# Altium schematic sheet Booster2.SchDoc (part 2 of 3)
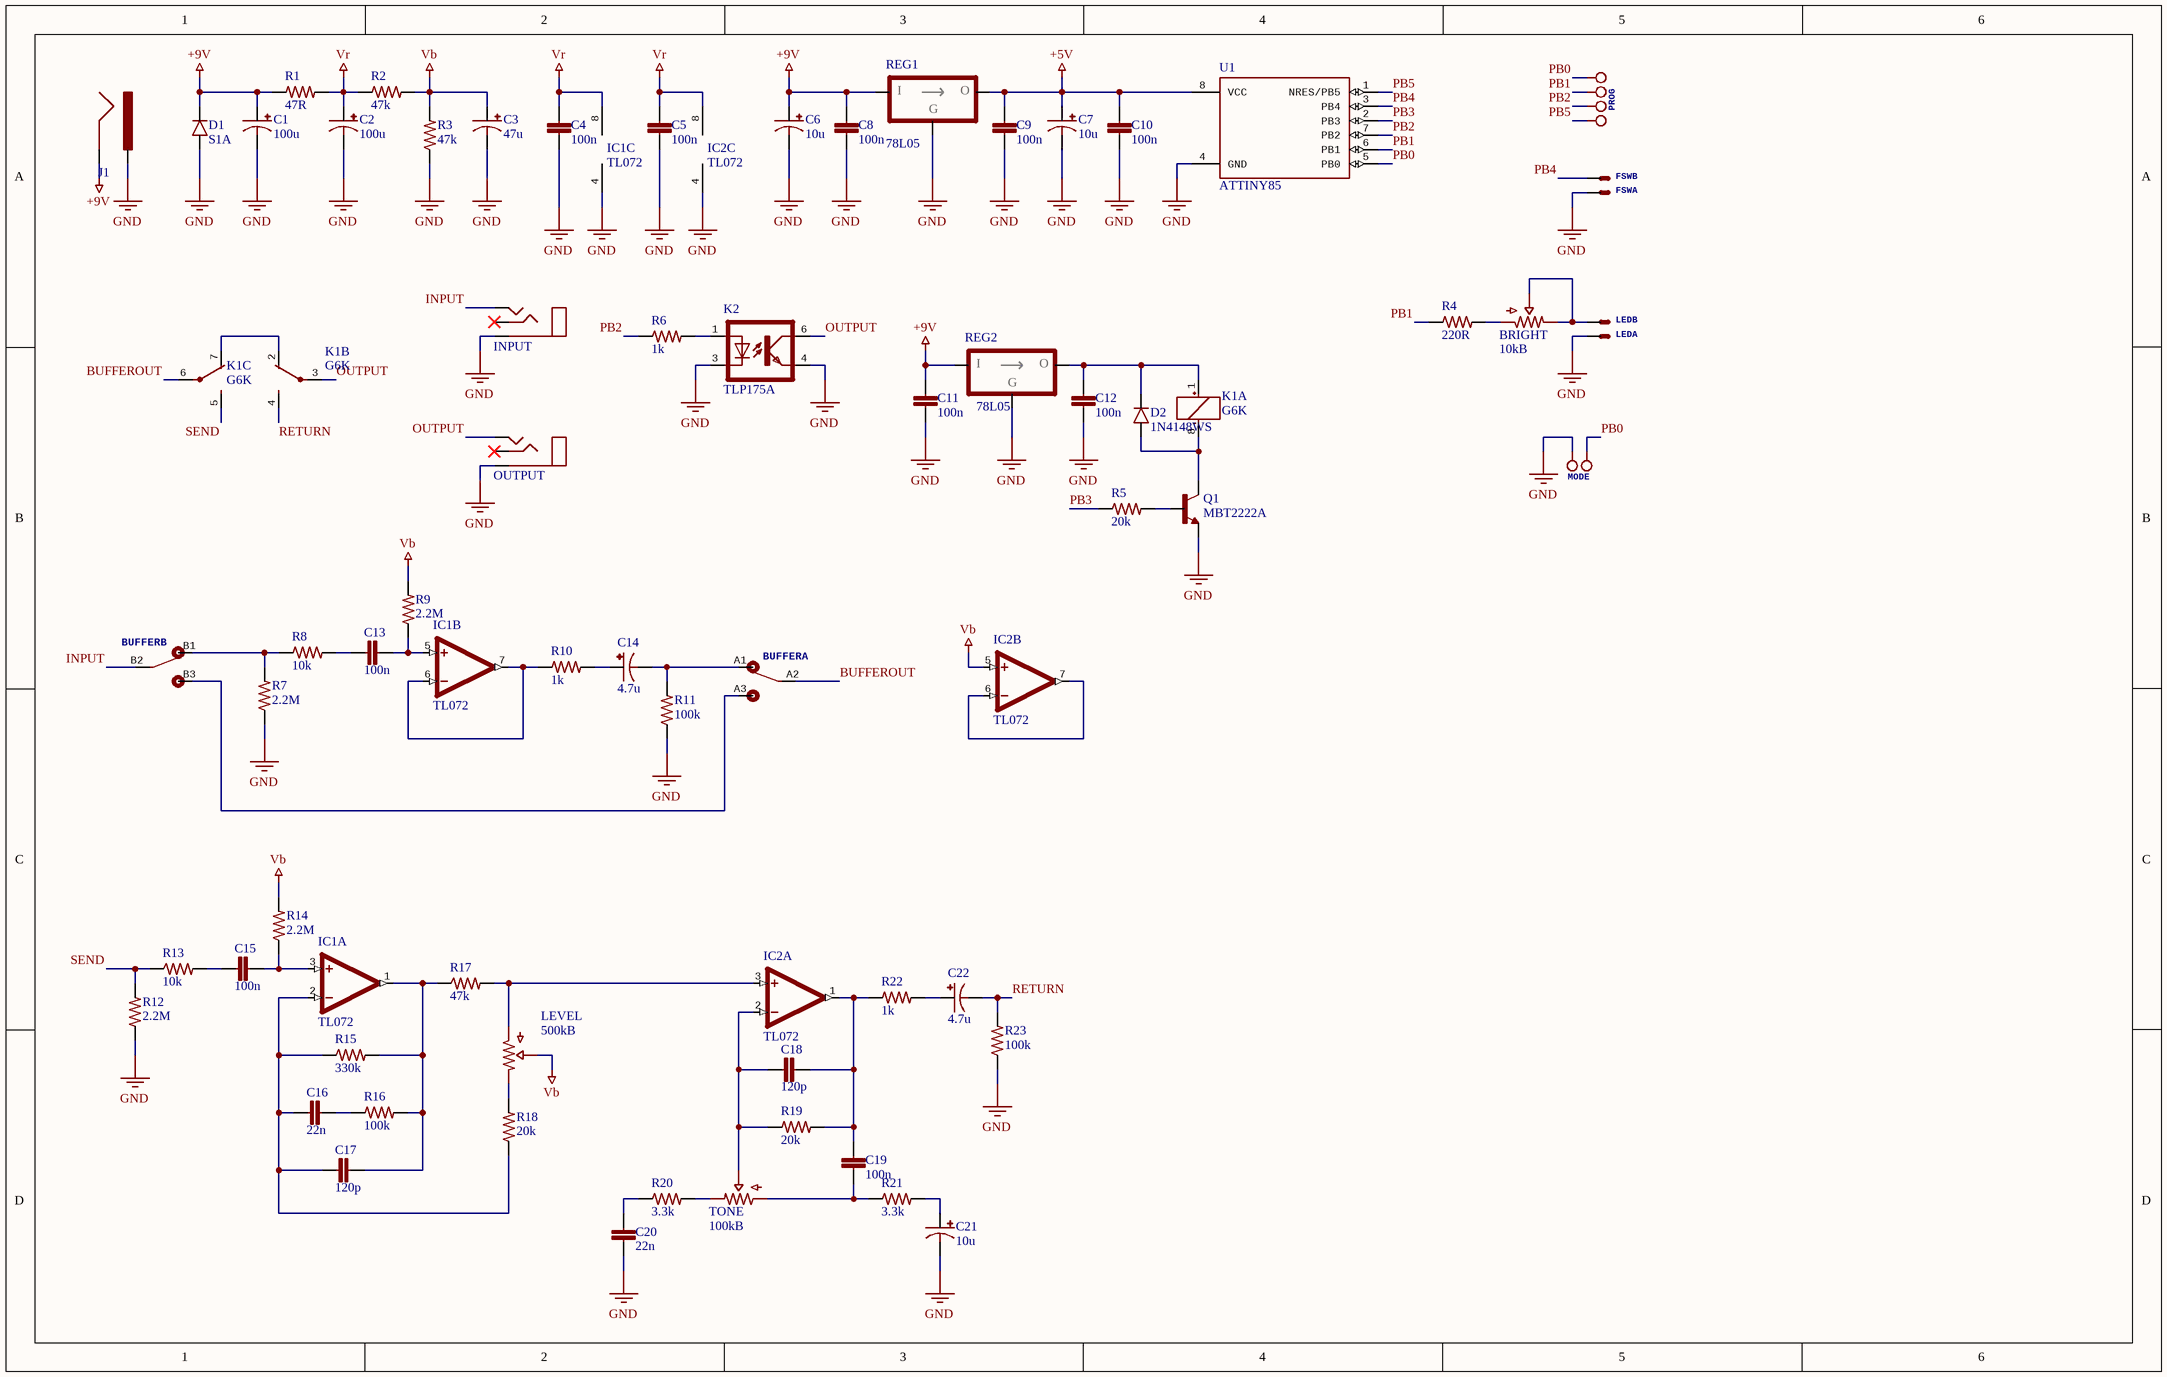
[diagram p1: Booster2.SchDoc]
## Library data of the parts
BRIGHT = TRIM_10kB_3362P: 10k Lin 3362P trimmer; Price: 0.1
BUFFER = SW_SLIDE_DPDT_ON-ON: DPDT slide switch ON/ON; Price: 0.5
C1 C2 = MCVVT025M101EA6L: CAP ALUM 100UF 25V SMD; Manufacturer: Multicomp; Life (Hours): 2000Hour; Ripple Current (AC): 6.3mA; Supplier 1: Farnell; Supplier Part Number 1: 2611370; Manufacturer Part Number: MCVVT025M101EA6L; Stock: 1063; Pricing: 1=0.157, 50=0.104, 100=0.0932, 250=0.0801, 500=0.0681 (EUR); RoHS: No; Min Operating Temperature: -55°C; Max Operating Temperature: 105°C; Capacitance: 100uF; Voltage Rating: 25V; Packaging: Tape and Reel; Voltage Rating (DC): 25V; Diameter: 6.3mm; Height: 7.7mm; REACH SVHC: No SVHC; ComponentLink1URL: http://www.farnell.com/datasheets/2151198.pdf?src-supplier=Element14; ComponentLink1Description: http://www.farnell.com/datasheets/2151198.pdf?src-supplier=Element14; Price: 0.102
C3 = MCVVT025M470EA1L: CAP ALUM 47UF 25V SMD; Manufacturer: Multicomp; Life (Hours): 2000Hour; Ripple Current (AC): 6.3mA; Supplier 1: Farnell; Supplier Part Number 1: 2611377; Manufacturer Part Number: MCVVT025M470EA1L; Stock: 1436; Pricing: 1=0.125, 50=0.0825, 100=0.0741, 250=0.0637, 500=0.0542 (EUR); RoHS: No; Min Operating Temperature: -55°C; Max Operating Temperature: 105°C; Capacitance: 47uF; Voltage Rating: 25V; Packaging: Cut Tape; Voltage Rating (DC): 25V; Diameter: 6.3mm; Height: 5.4mm; REACH SVHC: No SVHC; ComponentLink1URL: http://www.farnell.com/datasheets/2151198.pdf?src-supplier=Farnell; ComponentLink1Description: http://www.farnell.com/datasheets/2151198.pdf?src-supplier=Farnell; ComponentLink2URL: http://www.farnell.com/datasheets/2151198.pdf?src-supplier=Element14; ComponentLink2Description: http://www.farnell.com/datasheets/2151198.pdf?src-supplier=Element14; Price: 0.0825
C4 C5 C8-C12 = MC0603B104K500CT: CAP CER 100NF 50V X7R 0603; Manufacturer: Multicomp; Tolerance: 10%; Supplier 1: Farnell; Supplier Part Number 1: 1759122; Manufacturer Part Number: MC0603B104K500CT; Stock 1: 1057763; RoHS: Yes; Case/Package: 0603; Number of Pins: 2; Case Code (Metric): 1608; Case Code (Imperial): 0603; Min Operating Temperature: -55°C; Max Operating Temperature: 125°C; Packaging: Cut Tape; Voltage Rating: 50V; Capacitance: 100nF; Dielectric: X7R; Voltage Rating (DC): 50V; REACH SVHC: Unknown; ComponentLink1URL: https://datasheet.ciiva.com/22686/1901289-22686278.pdf?src-supplier=Element14; ComponentLink1Description: https://datasheet.ciiva.com/22686/1901289-22686278.pdf?src-supplier=Element14; ComponentLink2URL: https://datasheet.ciiva.com/22686/1901289-22686279.pdf?src-supplier=Element14; ComponentLink2Description: https://datasheet.ciiva.com/22686/1901289-22686279.pdf?src-supplier=Element14; ComponentLink3URL: https://datasheet.ciiva.com/22648/1901289-22648411.pdf?src-supplier=Element14; ComponentLink3Description: https://datasheet.ciiva.com/22648/1901289-22648411.pdf?src-supplier=Element14; Price: 0.0458
C6 C7 = MCVVT025M100CA1L: CAP ALUM 10UF 25V SMD; Manufacturer: Multicomp; Life (Hours): 2000Hour; Ripple Current (AC): 4mA; Supplier 1: Farnell; Supplier Part Number 1: 2611368; Manufacturer Part Number: MCVVT025M100CA1L; Stock: 2773; Pricing: 5=0.0897, 50=0.0592, 250=0.0457, 500=0.0388, 1000=0.0338 (EUR); RoHS: No; Min Operating Temperature: -55°C; Max Operating Temperature: 105°C; Capacitance: 10uF; Voltage Rating: 25V; Packaging: Cut Tape; Voltage Rating (DC): 25V; Diameter: 4mm; Height: 5.4mm; REACH SVHC: No SVHC; ComponentLink1URL: http://www.farnell.com/datasheets/2151198.pdf?src-supplier=Element14; ComponentLink1Description: http://www.farnell.com/datasheets/2151198.pdf?src-supplier=Element14; Price: 0.0592
C13 C15 C19 = GRM31C5C1H104JA01L: CAP CER 100NF 50V C0G/NP0 1206; Manufacturer: Murata; Material: Ceramic; Tolerance: 5%; Dielectric: C0G; Temperature Coefficient: 30ppm/°C; Supplier 1: Farnell; Supplier Part Number 1: 2494294; Manufacturer Part Number: GRM31C5C1H104JA01L; Stock 1: 206865; Pricing 1: 5 = 0.62500, 50 = 0.31000, 250 = 0.29700, 500 = 0.22200, 1000 = 0.18900 (EUR); RoHS: Yes; Mount: Surface Mount; Case/Package: 1206; Weight: 0.000571oz; Case Code (Metric): 3216; Case Code (Imperial): 1206; Min Operating Temperature: -55°C; Max Operating Temperature: 125°C; Capacitance: 100nF; Packaging: Tape and Reel; Package Quantity: 1; Voltage Rating: 50V; Voltage Rating (DC): 50V; Termination: SMD/SMT; Voltage: 50V; Length: 3.2mm; Height: 1.6mm; Width: 0.063inch; Thickness: 0.071inch; Depth: 1.6mm; Radiation Hardening: No; REACH SVHC: No SVHC; Lead Free: Lead Free; ComponentLink1URL: https://datasheet.ciiva.com/11618/product-11618880.pdf?src-supplier=Avnet; ComponentLink1Description: https://datasheet.ciiva.com/11618/product-11618880.pdf?src-supplier=Avnet; ComponentLink2URL: https://datasheet.ciiva.com/29200/453430-da-01-en-vs-kondensator-1206-29200201.pdf?src-supplier=Conrad; ComponentLink2Description: https://datasheet.ciiva.com/29200/453430-da-01-en-vs-kondensator-1206-29200201.pdf?src-supplier=Conrad; ComponentLink3URL: https://datasheet.ciiva.com/5420/product-5420070.pdf?src-supplier=Mouser; ComponentLink3Description: https://datasheet.ciiva.com/5420/product-5420070.pdf?src-supplier=Mouser; ComponentLink4URL: https://datasheet.ciiva.com/16461/product-16461275.pdf?src-supplier=Future+Electronics; ComponentLink4Description: https://datasheet.ciiva.com/16461/product-16461275.pdf?src-supplier=Future+Electronics; ComponentLink5URL: https://datasheet.ciiva.com/6270/partnumbering-e-01-6270255.pdf?src-supplier=Digi-Key; ComponentLink5Description: https://datasheet.ciiva.com/6270/partnumbering-e-01-6270255.pdf?src-supplier=Digi-Key; Price: 0.31
C14 C22 = EEEFC1H4R7R: CAP ALUM 4.7UF 50V LESR SMD; Manufacturer: Panasonic; Dielectric Material: Aluminium; Tolerance: 20%; Ripple Current: 50mA; Impedance: 3R; Life (Hours): 1000Hour; Leakage Current: 3uA; Lead Length: 2.2mm; Supplier 1: Farnell; Supplier Part Number 1: 9694552; Manufacturer Part Number: EEEFC1H4R7R; Stock 1: 1971; Pricing 1: 1 = 0.26900, 50 = 0.18200, 100 = 0.14200, 250 = 0.13200, 500 = 0.09890 (EUR); RoHS: Yes; Mount: Surface Mount; Case/Package: Radial; Number of Pins: 2; Contact Plating: Tin; Min Operating Temperature: -40°C; Max Operating Temperature: 105°C; Capacitance: 4.7uF; Voltage Rating: 50V; Packaging: Tape and Reel; Package Quantity: 1; Ripple Current (AC): 50mA; Voltage Rating (DC): 50V; ESR (Equivalent Series Resistance): 3R; Termination: SMD/SMT; Voltage: 50V; Diameter: 5mm; Length: 5.5mm; Height: 5.4mm; Height - Seated (Max): 0.213inch; Lead Pitch: 1.5mm; Width: 5.3mm; Radiation Hardening: No; REACH SVHC: No SVHC; Lead Free: Lead Free; ComponentLink1URL: https://datasheet.ciiva.com/11778/0900766b806bc525-11778368.pdf?src-supplier=RSComponents; ComponentLink1Description: https://datasheet.ciiva.com/11778/0900766b806bc525-11778368.pdf?src-supplier=RSComponents; ComponentLink2URL: https://datasheet.ciiva.com/6196/31718-6196262.pdf?src-supplier=Farnell; ComponentLink2Description: https://datasheet.ciiva.com/6196/31718-6196262.pdf?src-supplier=Farnell; ComponentLink3URL: https://datasheet.ciiva.com/30150/aba0000ce5-30150534.pdf?src-supplier=Onlinecomponents.com; ComponentLink3Description: https://datasheet.ciiva.com/30150/aba0000ce5-30150534.pdf?src-supplier=Onlinecomponents.com; ComponentLink4URL: https://datasheet.ciiva.com/48542/eeefc-series-eng-tds-48542743.pdf?src-supplier=Distrelec; ComponentLink4Description: https://datasheet.ciiva.com/48542/eeefc-series-eng-tds-48542743.pdf?src-supplier=Distrelec; ComponentLink5URL: https://datasheet.ciiva.com/14595/70256381-14595032.pdf?src-supplier=Allied+Electronics; ComponentLink5Description: https://datasheet.ciiva.com/14595/70256381-14595032.pdf?src-supplier=Allied+Electronics; ComponentLink6URL: https://datasheet.ciiva.com/43485/31718-43485416.pdf?src-supplier=Farnell; ComponentLink6Description: https://datasheet.ciiva.com/43485/31718-43485416.pdf?src-supplier=Farnell; ComponentLink7URL: https://datasheet.ciiva.com/24072/aba0000ce5-68492-24072137.pdf?src-supplier=Mouser; ComponentLink7Description: https://datasheet.ciiva.com/24072/aba0000ce5-68492-24072137.pdf?src-supplier=Mouser; ComponentLink8URL: https://datasheet.ciiva.com/14602/70256381-14602202.pdf?src-supplier=Allied+Electronics; ComponentLink8Description: https://datasheet.ciiva.com/14602/70256381-14602202.pdf?src-supplier=Allied+Electronics; ComponentLink9URL: https://datasheet.ciiva.com/46376/31718-46376378.pdf?src-supplier=Element14; ComponentLink9Description: https://datasheet.ciiva.com/46376/31718-46376378.pdf?src-supplier=Element14; ComponentLink10URL: https://datasheet.ciiva.com/14596/70068018-14596798.pdf?src-supplier=Allied+Electronics; ComponentLink10Description: https://datasheet.ciiva.com/14596/70068018-14596798.pdf?src-supplier=Allied+Electronics; Price: 0.27
C16 C20 = GRM21B5C1H223JA01L: CAP CER 22NF 50V C0G/NP0 0805; Manufacturer: Murata; Material: Ceramic; Tolerance: 5%; Dielectric: C0G; Voltage: 25V; Temperature Coefficient: 30ppm/°C; Supplier 1: Farnell; Supplier Part Number 1: 1828943; Manufacturer Part Number: GRM21B5C1H223JA01L; Stock 1: 85144; Pricing 1: 5 = 0.38000, 50 = 0.19100, 250 = 0.16400, 500 = 0.10400, 1500 = 0.08380 (EUR); RoHS: Yes; Mount: Surface Mount; Case/Package: 0805; Number of Pins: 2; Case Code (Metric): 2012; Case Code (Imperial): 0805; Min Operating Temperature: -55°C; Max Operating Temperature: 125°C; Capacitance: 22nF; Voltage Rating: 50V; Package Quantity: 1; Packaging: Tape and Reel; Voltage Rating (DC): 50V; Termination: SMD/SMT; Length: 2mm; Height: 1.25mm; Width: 0.049inch; Thickness: 0.053inch; Depth: 1.25mm; Radiation Hardening: No; REACH SVHC: No SVHC; Lead Free: Lead Free; ComponentLink1URL: https://datasheet.ciiva.com/2989/product-2989681.pdf?src-supplier=Avnet; ComponentLink1Description: https://datasheet.ciiva.com/2989/product-2989681.pdf?src-supplier=Avnet; ComponentLink2URL: https://datasheet.ciiva.com/29042/1858738-29042965.pdf?src-supplier=Jameco; ComponentLink2Description: https://datasheet.ciiva.com/29042/1858738-29042965.pdf?src-supplier=Jameco; ComponentLink3URL: https://datasheet.ciiva.com/3777/99grm21b5c1h223ja0123-3777023.pdf?src-supplier=Arrow; ComponentLink3Description: https://datasheet.ciiva.com/3777/99grm21b5c1h223ja0123-3777023.pdf?src-supplier=Arrow; ComponentLink4URL: https://datasheet.ciiva.com/29200/453051-da-01-en-vs-kondensator-0805-29200670.pdf?src-supplier=Conrad; ComponentLink4Description: https://datasheet.ciiva.com/29200/453051-da-01-en-vs-kondensator-0805-29200670.pdf?src-supplier=Conrad; ComponentLink5URL: https://datasheet.ciiva.com/138/partnumbering-e-01-138787.pdf?src-supplier=Digi-Key; ComponentLink5Description: https://datasheet.ciiva.com/138/partnumbering-e-01-138787.pdf?src-supplier=Digi-Key; ComponentLink6URL: https://datasheet.ciiva.com/138/partnumbering-e-01-138789.pdf?src-supplier=Digi-Key; ComponentLink6Description: https://datasheet.ciiva.com/138/partnumbering-e-01-138789.pdf?src-supplier=Digi-Key; ComponentLink7URL: https://datasheet.ciiva.com/22703/608985-22703464.pdf?src-supplier=Element14; ComponentLink7Description: https://datasheet.ciiva.com/22703/608985-22703464.pdf?src-supplier=Element14; ComponentLink8URL: https://datasheet.ciiva.com/7828/608985-7828990.pdf?src-supplier=Element14; ComponentLink8Description: https://datasheet.ciiva.com/7828/608985-7828990.pdf?src-supplier=Element14; ComponentLink9URL: https://datasheet.ciiva.com/138/partnumbering-e-01-138788.pdf?src-supplier=Digi-Key; ComponentLink9Description: https://datasheet.ciiva.com/138/partnumbering-e-01-138788.pdf?src-supplier=Digi-Key; Price: 0.191
C17 C18 = MC0603N121J500CT: CAP CER 120PF 50V C0G/NP0 0603; Manufacturer: Multicomp; Tolerance: 5%; Dielectric: C0G; Temperature Coefficient: 30ppm/°C; Supplier 1: Farnell; Supplier Part Number 1: 1759067; Manufacturer Part Number: MC0603N121J500CT; Stock: 19090; Pricing: 10=0.0363, 100=0.0246, 500=0.0182, 1000=0.0144, 2000=0.0119 (EUR); RoHS: Yes; Case/Package: 0603; Number of Pins: 2; Case Code (Metric): 1608; Case Code (Imperial): 0603; Min Operating Temperature: -55°C; Max Operating Temperature: 125°C; Capacitance: 120pF; Voltage Rating: 50V; Packaging: Cut Tape; Voltage Rating (DC): 50V; Width: 0.8mm; REACH SVHC: Unknown; ComponentLink1URL: https://datasheet.ciiva.com/7751/ta-1098-7751430.pdf?src-supplier=Element14; ComponentLink1Description: https://datasheet.ciiva.com/7751/ta-1098-7751430.pdf?src-supplier=Element14; ComponentLink2URL: https://datasheet.ciiva.com/22648/1901289-22648473.pdf?src-supplier=Element14; ComponentLink2Description: https://datasheet.ciiva.com/22648/1901289-22648473.pdf?src-supplier=Element14; ComponentLink3URL: https://datasheet.ciiva.com/22648/1901289-22648474.pdf?src-supplier=Element14; ComponentLink3Description: https://datasheet.ciiva.com/22648/1901289-22648474.pdf?src-supplier=Element14; ComponentLink4URL: https://datasheet.ciiva.com/41653/ta-1098-41653965.pdf?src-supplier=Farnell; ComponentLink4Description: https://datasheet.ciiva.com/41653/ta-1098-41653965.pdf?src-supplier=Farnell; Price: 0.0246
C21 = EEEFC1H100P: CAP ALUM 10UF 20% 50V LESR SMD; Manufacturer: Panasonic; Material: Aluminium; Ripple Current: 70mA; Impedance: 2R; Polarity: Polar; Life (Hours): 1000Hour; Leakage Current: 3uA; Lead Length: 2.6mm; Supplier 1: Farnell; Supplier Part Number 1: 9694560; Manufacturer Part Number: EEEFC1H100P; Stock: 7178; Pricing: 1=0.369, 50=0.219, 100=0.16, 250=0.156, 500=0.118 (EUR); RoHS: Yes; Mount: Surface Mount; Case/Package: Radial; Number of Pins: 2; Dielectric Material: Aluminium; Min Operating Temperature: -40°C; Max Operating Temperature: 105°C; Capacitance: 10uF; Tolerance: 20%; Voltage Rating: 50V; Packaging: Tape and Reel; Package Quantity: 1000; Ripple Current (AC): 70mA; Voltage Rating (DC): 50V; ESR (Equivalent Series Resistance): 2R; Termination: SMD/SMT; Voltage: 50V; Diameter: 6.3mm; Length: 5.5mm; Height: 5.4mm; Lead Pitch: 1.8mm; Height - Seated (Max): 0.213inch; Width: 6.6mm; Radiation Hardening: No; REACH SVHC: No SVHC; Lead Free: Lead Free; ComponentLink1URL: https://datasheet.ciiva.com/11777/0900766b80e4a876-11777374.pdf?src-supplier=RSComponents; ComponentLink1Description: https://datasheet.ciiva.com/11777/0900766b80e4a876-11777374.pdf?src-supplier=RSComponents; ComponentLink2URL: https://datasheet.ciiva.com/25613/0900766b806bc525-25613719.pdf?src-supplier=RSComponents; ComponentLink2Description: https://datasheet.ciiva.com/25613/0900766b806bc525-25613719.pdf?src-supplier=RSComponents; ComponentLink3URL: https://datasheet.ciiva.com/43485/31718-43485417.pdf?src-supplier=Farnell; ComponentLink3Description: https://datasheet.ciiva.com/43485/31718-43485417.pdf?src-supplier=Farnell; ComponentLink4URL: https://datasheet.ciiva.com/43463/31718-43463467.pdf?src-supplier=Farnell; ComponentLink4Description: https://datasheet.ciiva.com/43463/31718-43463467.pdf?src-supplier=Farnell; ComponentLink5URL: https://datasheet.ciiva.com/46376/31718-46376383.pdf?src-supplier=Element14; ComponentLink5Description: https://datasheet.ciiva.com/46376/31718-46376383.pdf?src-supplier=Element14; ComponentLink6URL: https://datasheet.ciiva.com/14603/70256381-14603525.pdf?src-supplier=Allied+Electronics; ComponentLink6Description: https://datasheet.ciiva.com/14603/70256381-14603525.pdf?src-supplier=Allied+Electronics; ComponentLink7URL: https://datasheet.ciiva.com/16394/aba0000ce5-16394405.pdf?src-supplier=Future+Electronics; ComponentLink7Description: https://datasheet.ciiva.com/16394/aba0000ce5-16394405.pdf?src-supplier=Future+Electronics; ComponentLink8URL: https://datasheet.ciiva.com/48542/eeefc-series-eng-tds-48542742.pdf?src-supplier=Distrelec; ComponentLink8Description: https://datasheet.ciiva.com/48542/eeefc-series-eng-tds-48542742.pdf?src-supplier=Distrelec; ComponentLink9URL: https://datasheet.ciiva.com/24069/aba0000ce5-68492-24069287.pdf?src-supplier=Mouser; ComponentLink9Description: https://datasheet.ciiva.com/24069/aba0000ce5-68492-24069287.pdf?src-supplier=Mouser; ComponentLink10URL: https://datasheet.ciiva.com/14588/70068018-14588537.pdf?src-supplier=Allied+Electronics; ComponentLink10Description: https://datasheet.ciiva.com/14588/70068018-14588537.pdf?src-supplier=Allied+Electronics; ComponentLink11URL: https://datasheet.ciiva.com/6121/31718-6121404.pdf?src-supplier=Farnell; ComponentLink11Description: https://datasheet.ciiva.com/6121/31718-6121404.pdf?src-supplier=Farnell; ComponentLink12URL: https://datasheet.ciiva.com/46388/31718-46388044.pdf?src-supplier=Element14; ComponentLink12Description: https://datasheet.ciiva.com/46388/31718-46388044.pdf?src-supplier=Element14; ComponentLink13URL: https://datasheet.ciiva.com/30236/aba0000ce5-30236333.pdf?src-supplier=Onlinecomponents.com; ComponentLink13Description: https://datasheet.ciiva.com/30236/aba0000ce5-30236333.pdf?src-supplier=Onlinecomponents.com; ComponentLink14URL: https://datasheet.ciiva.com/46388/31718-46388045.pdf?src-supplier=Element14; ComponentLink14Description: https://datasheet.ciiva.com/46388/31718-46388045.pdf?src-supplier=Element14; ComponentLink15URL: https://datasheet.ciiva.com/16539/aba0000ce5-16539967.pdf?src-supplier=Avnet+Asia; ComponentLink15Description: https://datasheet.ciiva.com/16539/aba0000ce5-16539967.pdf?src-supplier=Avnet+Asia; Price: 0.174
D1 = S1A: DIODE GEN PURP 50V 1A SMA; Manufacturer: ON Semiconductor / Fairchild; Peak Reverse Current: 1uA; Max Surge Current: 40A; Forward Voltage: 1.1V; Peak Non-Repetitive Surge Current: 30A; Element Configuration: Single; Capacitance: 12pF; Recovery Time: 1800ns; Reverse Recovery Time: 1.8us; Polarity: Standard; Power Dissipation: 1.4W; Supplier 1: Farnell; Supplier Part Number 1: 9843868; Manufacturer Part Number: S1A; Stock: 34555; Pricing: 5=0.184, 25=0.179, 100=0.0727, 250=0.0669, 500=0.0667, 1000=0.0364, 5000=0.0293 (EUR); RoHS: Yes; Mount: Surface Mount; Case/Package: SMA; Number of Pins: 2; Weight: 0.106g; Contact Plating: Tin; Min Operating Temperature: -55°C; Max Operating Temperature: 150°C; Packaging: Tape and Reel; Package Quantity: 1; Voltage Rating (DC): 50V; Current Rating: 1A; Output Current: 1A; Forward Current: 1A; Max Repetitive Reverse Voltage (Vrrm): 50V; Average Rectified Current: 1A; Max Forward Surge Current (Ifsm): 30A; Max Reverse Voltage (DC): 50V; Reverse Voltage: 50V; Width: 5.28mm; Radiation Hardening: No; REACH SVHC: No SVHC; Lead Free: Lead Free; ComponentLink1URL: https://datasheet.ciiva.com/910/s1a-910480.pdf?src-supplier=Avnet; ComponentLink1Description: https://datasheet.ciiva.com/910/s1a-910480.pdf?src-supplier=Avnet; ComponentLink2URL: https://datasheet.ciiva.com/23683/1730038-23683616.pdf?src-supplier=Newark; ComponentLink2Description: https://datasheet.ciiva.com/23683/1730038-23683616.pdf?src-supplier=Newark; ComponentLink3URL: https://datasheet.ciiva.com/4452/s1a-191336-4452662.pdf?src-supplier=Mouser; ComponentLink3Description: https://datasheet.ciiva.com/4452/s1a-191336-4452662.pdf?src-supplier=Mouser; ComponentLink4URL: https://datasheet.ciiva.com/25624/0900766b80f9b629-25624903.pdf?src-supplier=RSComponents; ComponentLink4Description: https://datasheet.ciiva.com/25624/0900766b80f9b629-25624903.pdf?src-supplier=RSComponents; ComponentLink5URL: https://datasheet.ciiva.com/916/s1a-916898.pdf?src-supplier=Digi-Key; ComponentLink5Description: https://datasheet.ciiva.com/916/s1a-916898.pdf?src-supplier=Digi-Key; ComponentLink6URL: https://datasheet.ciiva.com/916/s1a-916899.pdf?src-supplier=Digi-Key; ComponentLink6Description: https://datasheet.ciiva.com/916/s1a-916899.pdf?src-supplier=Digi-Key; ComponentLink7URL: https://datasheet.ciiva.com/916/s1a-916900.pdf?src-supplier=Digi-Key; ComponentLink7Description: https://datasheet.ciiva.com/916/s1a-916900.pdf?src-supplier=Digi-Key; ComponentLink8URL: https://datasheet.ciiva.com/16800/s1a-16800103.pdf?src-supplier=Future+Electronics; ComponentLink8Description: https://datasheet.ciiva.com/16800/s1a-16800103.pdf?src-supplier=Future+Electronics; ComponentLink9URL: https://datasheet.ciiva.com/28469/1766308-28469031.pdf?src-supplier=Element14; ComponentLink9Description: https://datasheet.ciiva.com/28469/1766308-28469031.pdf?src-supplier=Element14; ComponentLink10URL: https://datasheet.ciiva.com/26231/s1k-26231832.pdf?src-supplier=Avnet+Europe; ComponentLink10Description: https://datasheet.ciiva.com/26231/s1k-26231832.pdf?src-supplier=Avnet+Europe; ComponentLink11URL: https://datasheet.ciiva.com/16474/s1k-16474283.pdf?src-supplier=Avnet+Asia; ComponentLink11Description: https://datasheet.ciiva.com/16474/s1k-16474283.pdf?src-supplier=Avnet+Asia; Price: 0.072
D2 = 1N4148WS: DIODE GEN PURP 75V 150MA SOD323F; Manufacturer: ON Semiconductor / Fairchild; Element Configuration: Single; Reverse Recovery Time: 4ns; Forward Voltage: 1V; Peak Reverse Current: 5uA; Power Dissipation: 200mW; Max Forward Surge Current (Ifsm): 2A; Supplier 1: Farnell; Supplier Part Number 1: 2453269; Manufacturer Part Number: 1N4148WS; Stock: 379338; Pricing: 5=0.155, 25=0.151, 100=0.0529, 250=0.0498, 500=0.0477, 1000=0.0243, 5000=0.0193 (EUR); RoHS: Yes; Mount: Surface Mount; Number of Pins: 2; Weight: 0.0276g; Contact Plating: Tin; Min Operating Temperature: -55°C; Max Operating Temperature: 150°C; Forward Current: 150mA; Max Repetitive Reverse Voltage (Vrrm): 75V; Packaging: Tape and Reel; Package Quantity: 1; Average Rectified Current: 150mA; Max Reverse Voltage (DC): 75V; Recovery Time: 4ns; Reverse Voltage: 75V; Length: 1.8mm; Height: 1mm; Width: 1.35mm; Radiation Hardening: No; Lead Free: Lead Free; REACH SVHC: No SVHC; ComponentLink1URL: https://datasheet.ciiva.com/25968/1n914bws-25968945.pdf?src-supplier=Avnet+Europe; ComponentLink1Description: https://datasheet.ciiva.com/25968/1n914bws-25968945.pdf?src-supplier=Avnet+Europe; ComponentLink2URL: https://datasheet.ciiva.com/30479/0900766b810e1cd3-30479206.pdf?src-supplier=RSComponents; ComponentLink2Description: https://datasheet.ciiva.com/30479/0900766b810e1cd3-30479206.pdf?src-supplier=RSComponents; ComponentLink3URL: https://datasheet.ciiva.com/15208/getdatasheetpartid-127819-15208358.pdf?src-supplier=Verical; ComponentLink3Description: https://datasheet.ciiva.com/15208/getdatasheetpartid-127819-15208358.pdf?src-supplier=Verical; ComponentLink4URL: https://datasheet.ciiva.com/8300/1n914bws-8300360.pdf?src-supplier=Avnet; ComponentLink4Description: https://datasheet.ciiva.com/8300/1n914bws-8300360.pdf?src-supplier=Avnet; ComponentLink5URL: https://datasheet.ciiva.com/910/1n4148ws-910380.pdf?src-supplier=Digi-Key; ComponentLink5Description: https://datasheet.ciiva.com/910/1n4148ws-910380.pdf?src-supplier=Digi-Key; ComponentLink6URL: https://datasheet.ciiva.com/910/1n4148ws-910381.pdf?src-supplier=Digi-Key; ComponentLink6Description: https://datasheet.ciiva.com/910/1n4148ws-910381.pdf?src-supplier=Digi-Key; ComponentLink7URL: https://datasheet.ciiva.com/910/1n4148ws-910382.pdf?src-supplier=Digi-Key; ComponentLink7Description: https://datasheet.ciiva.com/910/1n4148ws-910382.pdf?src-supplier=Digi-Key; Price: 0.0521
FSW LED = J_JST-XH-02: 2 Pins male XH header; Price: 0.1
IC1 IC2 = TL072CDT: IC OPAMP JFET 4MHZ 8SO; Manufacturer: STMicroelectronics; Common Mode Rejection Ratio: 70dB; Min Dual Supply Voltage: 3V; Voltage Gain: 106.02dB; Slew Rate: 16V/µs; Min Supply Voltage: 6V; Max Supply Voltage: 36V; Max Dual Supply Voltage: 18V; Number of Channels: 2; Dual Supply Voltage: 9V; Output Current: 40mA; Nominal Supply Current: 2.5mA; Input Bias Current: 200pA; Input Offset Voltage (Vos): 10mV; Operating Supply Current: 1.4mA; Supplier 1: Farnell; Supplier Part Number 1: 1467663; Manufacturer Part Number: TL072CDT; Stock: 1760; Pricing: 5=0.351, 50=0.313, 100=0.188, 500=0.167, 1000=0.145 (EUR); RoHS: Yes; Mount: Surface Mount; Case/Package: SOIC; Number of Pins: 8; Weight: 0.01lb; Contact Plating: Tin; Min Operating Temperature: 0°C; Max Operating Temperature: 70°C; Gain Bandwidth Product: 4MHz; Unity Gain Bandwidth Product: 4MHz; Packaging: Tape and Reel; Package Quantity: 1; Bandwidth: 4MHz; Operating Supply Voltage: 18V; Number of Circuits: 2; Output Current per Channel: 40mA; Number of Elements: 2; Number of Amplifiers: 2; Length: 4.9mm; Height: 1.25mm; Width: 3.9mm; Radiation Hardening: No; REACH SVHC: No SVHC; Lead Free: Lead Free; ComponentLink1URL: https://datasheet.ciiva.com/15129/getdatasheetpartid-40113-15129688.pdf?src-supplier=Verical; ComponentLink1Description: https://datasheet.ciiva.com/15129/getdatasheetpartid-40113-15129688.pdf?src-supplier=Verical; ComponentLink2URL: https://datasheet.ciiva.com/29306/155616-da-01-en-op-verst-tl072cdt-stm-29306849.pdf?src-supplier=Conrad; ComponentLink2Description: https://datasheet.ciiva.com/29306/155616-da-01-en-op-verst-tl072cdt-stm-29306849.pdf?src-supplier=Conrad; ComponentLink3URL: https://datasheet.ciiva.com/26847/tl072cdt-26847276.pdf?src-supplier=IIIC; ComponentLink3Description: https://datasheet.ciiva.com/26847/tl072cdt-26847276.pdf?src-supplier=IIIC; ComponentLink4URL: https://datasheet.ciiva.com/1795/cd00000490-1795664.pdf?src-supplier=Digi-Key; ComponentLink4Description: https://datasheet.ciiva.com/1795/cd00000490-1795664.pdf?src-supplier=Digi-Key; ComponentLink5URL: https://datasheet.ciiva.com/1795/cd00000490-1795665.pdf?src-supplier=Digi-Key; ComponentLink5Description: https://datasheet.ciiva.com/1795/cd00000490-1795665.pdf?src-supplier=Digi-Key; ComponentLink6URL: https://datasheet.ciiva.com/1795/cd00000490-1795666.pdf?src-supplier=Digi-Key; ComponentLink6Description: https://datasheet.ciiva.com/1795/cd00000490-1795666.pdf?src-supplier=Digi-Key; ComponentLink7URL: https://datasheet.ciiva.com/8008/1674510-8008556.pdf?src-supplier=Element14; ComponentLink7Description: https://datasheet.ciiva.com/8008/1674510-8008556.pdf?src-supplier=Element14; ComponentLink8URL: https://datasheet.ciiva.com/14151/tl072-tl072a-tl072b-st-tds-eng-14151196.pdf?src-supplier=Distrelec; ComponentLink8Description: https://datasheet.ciiva.com/14151/tl072-tl072a-tl072b-st-tds-eng-14151196.pdf?src-supplier=Distrelec; ComponentLink9URL: https://datasheet.ciiva.com/8008/1674510-8008557.pdf?src-supplier=Element14; ComponentLink9Description: https://datasheet.ciiva.com/8008/1674510-8008557.pdf?src-supplier=Element14; Price: 0.351
INPUT OUTPUT = J_STEREO: 6.35mm stereo insulated socket jack PCB mounted; Price: 0.5
J1 = J_DC_JACK: DC Power jack 2.1mm barrel; Price: 0.05
K1 = G6K-2F5DC: OMRON - G6K-2F 5DC - RELAY, SIGNAL, DPDT, 30VDC, 1A; Manufacturer: Cliff; Coil Resistance: 237R; Coil Voltage (DC): 5V; Coil Current: 21.1mA; Coil Power: 100mW; Coil Type: Non-Latching; Release Time: 1.3ms; Contact Resistance: 100mR; Insulation Resistance: 1GR; Number of Poles: 2; Supplier 1: Farnell; Supplier Part Number 1: 4446185; Manufacturer Part Number: G6K-2F5DC; Stock: 0; RoHS: Yes; Mount: PCB; Case/Package: SMD/SMT; Contact Material: Gold; Min Operating Temperature: -40°C; Max Operating Temperature: 70°C; Contact Current Rating: 1A; Termination: SMD/SMT; Current Rating: 21.1mA; Power Rating: 100mW; Length: 10mm; Height: 5.2mm; Depth: 7.8mm; Width: 10mm; REACH SVHC: Unknown; ComponentLink1URL: https://datasheet.ciiva.com/1524/1702879-1524968.pdf?src-supplier=Element14; ComponentLink1Description: https://datasheet.ciiva.com/1524/1702879-1524968.pdf?src-supplier=Element14; Price: 2.68
K2 = TLP175A: Toshiba TLP175A AC Input MOSFET Output Optocoupler, Surface Mount, 4-Pin SOIC; Isolation Voltage: 3.75kV; Max Input Current: 80mA; Number of Channels: 1; Rise Time: 1ms; Supplier 1: Farnell; Supplier Part Number 1: 2524257; Manufacturer: Toshiba; Manufacturer Part Number: TLP175A; Stock: 0; Pricing: 5=0.877, 25=0.717, 100=0.597, 250=0.546, 500=0.49, 1000=0.441 (EUR); RoHS: No; Mount: Surface Mount; Case/Package: SOIC; Number of Pins: 4; Fall Time: 1ms; REACH SVHC: Unknown; ComponentLink1URL: http://www.farnell.com/datasheets/2017792.pdf?src-supplier=Farnell; ComponentLink1Description: http://www.farnell.com/datasheets/2017792.pdf?src-supplier=Farnell; ComponentLink2URL: http://uk.rs-online.com/webdocs/129d/0900766b8129d5be.pdf?src-supplier=RSComponents; ComponentLink2Description: http://uk.rs-online.com/webdocs/129d/0900766b8129d5be.pdf?src-supplier=RSComponents; ComponentLink3URL: http://www.farnell.com/datasheets/2017792.pdf?src-supplier=Element14; ComponentLink3Description: http://www.farnell.com/datasheets/2017792.pdf?src-supplier=Element14; ComponentLink4URL: http://www.farnell.com/datasheets/2017792.pdf?src-supplier=Newark; ComponentLink4Description: http://www.farnell.com/datasheets/2017792.pdf?src-supplier=Newark; Price: 0.829
LEVEL = POT_500kB_ALPHA_16mm: 500k Lin potentiometer round shaft; Price: 0.5; Dimensions: 16mm; Package: PCB Mounted
MODE = J_HEADER_2PINS: 2 Pins male header; Pin spacing: 2.54mm; Price: 0.01
PROG = J_HEADER_4PINS_FEM: 4 Pins female header; Pin spacing: 2.54mm; Price: 0.01
Q1 = MMBT2222AWT1G: TRANS NPN 40V 0.6A SOT323; Manufacturer: ON Semiconductor; Frequency: 300MHz; hFE Min: 35; Max Power Dissipation: 150mW; Collector Base Voltage (VCBO): 75V; Emitter Base Voltage (VEBO): 6V; Collector Emitter Saturation Voltage: 1V; Max Collector Current: 600mA; Number of Elements: 1; Element Configuration: Single; Max Frequency: 100MHz; Current Rating: 28A; Supplier 1: Farnell; Supplier Part Number 1: 2317589; Manufacturer Part Number: MMBT2222AWT1G; Stock: 16918; Pricing: 5=0.118, 50=0.114, 100=0.0413, 500=0.025, 1500=0.024 (EUR); RoHS: Yes; Case/Package: SC; Number of Pins: 3; Contact Plating: Tin; Min Operating Temperature: -55°C; Max Operating Temperature: 150°C; Package Quantity: 1; Collector Emitter Voltage (VCEO): 40V; Packaging: Tape and Reel; Polarity: NPN; Collector Emitter Breakdown Voltage: 40V; Transition Frequency: 300MHz; Power Dissipation: 150mW; Gain Bandwidth Product: 300MHz; Max Breakdown Voltage: 40V; Voltage Rating (DC): 40V; Length: 2.2mm; Height: 1mm; Width: 1.35mm; Radiation Hardening: No; Lead Free: Lead Free; REACH SVHC: No SVHC; ComponentLink1URL: https://datasheet.ciiva.com/15139/getdatasheetpartid-76779-15139056.pdf?src-supplier=Verical; ComponentLink1Description: https://datasheet.ciiva.com/15139/getdatasheetpartid-76779-15139056.pdf?src-supplier=Verical; ComponentLink2URL: https://datasheet.ciiva.com/4722/mmbt2222awt1-d-110211-4722257.pdf?src-supplier=Mouser; ComponentLink2Description: https://datasheet.ciiva.com/4722/mmbt2222awt1-d-110211-4722257.pdf?src-supplier=Mouser; ComponentLink3URL: https://datasheet.ciiva.com/16478/mmbt2222awt1-d-16478517.pdf?src-supplier=Avnet+Asia; ComponentLink3Description: https://datasheet.ciiva.com/16478/mmbt2222awt1-d-16478517.pdf?src-supplier=Avnet+Asia; ComponentLink4URL: https://datasheet.ciiva.com/11201/mmbt2222awt1-d-11201756.pdf?src-supplier=Avnet; ComponentLink4Description: https://datasheet.ciiva.com/11201/mmbt2222awt1-d-11201756.pdf?src-supplier=Avnet; ComponentLink5URL: https://datasheet.ciiva.com/16221/mmbt2222awt1-d-16221845.pdf?src-supplier=Future+Electronics; ComponentLink5Description: https://datasheet.ciiva.com/16221/mmbt2222awt1-d-16221845.pdf?src-supplier=Future+Electronics; ComponentLink6URL: https://datasheet.ciiva.com/7972/mmbt2222awt1-d-7972374.pdf?src-supplier=Element14; ComponentLink6Description: https://datasheet.ciiva.com/7972/mmbt2222awt1-d-7972374.pdf?src-supplier=Element14; ComponentLink7URL: https://datasheet.ciiva.com/22664/1708260-22664154.pdf?src-supplier=Element14; ComponentLink7Description: https://datasheet.ciiva.com/22664/1708260-22664154.pdf?src-supplier=Element14; ComponentLink8URL: https://datasheet.ciiva.com/976/mmbt2222awt1-d-976443.pdf?src-supplier=Digi-Key; ComponentLink8Description: https://datasheet.ciiva.com/976/mmbt2222awt1-d-976443.pdf?src-supplier=Digi-Key; Price: 0.0413
R1 = CRCW120647R0FKEA: RES SMD 47 OHM 1% 1/4W 1206; Manufacturer: Vishay; Temperature Coefficient: 100ppm/°C; Power Rating: 250mW; Voltage Rating: 200V; Supplier 1: Farnell; Supplier Part Number 1: 1470017; Manufacturer Part Number: CRCW120647R0FKEA; Stock: 90018; Pricing: 10=0.0369, 100=0.0246, 500=0.0205, 1000=0.0135, 2500=0.0108 (EUR); RoHS: Yes; Mount: Surface Mount; Case/Package: 1206; Weight: 0.000353oz; Contact Plating: Tin; Case Code (Metric): 3216; Case Code (Imperial): 1206; Min Operating Temperature: -55°C; Max Operating Temperature: 155°C; Resistance: 47R; Tolerance: 1%; Composition: Thick Film; Termination: SMD/SMT; Package Quantity: 10; Packaging: Tape and Reel; Number of Terminations: 2; Military Standard: Not; Max Power Dissipation: 250mW; Features: Automotive AEC-Q200; Voltage Rating (DC): 200V; Length: 3.2mm; Height: 0.55mm; Width: 0.063inch; Depth: 1.6mm; Radiation Hardening: No; REACH SVHC: Unknown; Lead Free: Lead Free; ComponentLink1URL: https://datasheet.ciiva.com/11818/0900766b80d98b5e-11818252.pdf?src-supplier=RSComponents; ComponentLink1Description: https://datasheet.ciiva.com/11818/0900766b80d98b5e-11818252.pdf?src-supplier=RSComponents; ComponentLink2URL: https://datasheet.ciiva.com/2469/dcrcwe3-2469056.pdf?src-supplier=Digi-Key; ComponentLink2Description: https://datasheet.ciiva.com/2469/dcrcwe3-2469056.pdf?src-supplier=Digi-Key; ComponentLink3URL: https://datasheet.ciiva.com/16760/70201119-16760313.pdf?src-supplier=Allied+Electronics; ComponentLink3Description: https://datasheet.ciiva.com/16760/70201119-16760313.pdf?src-supplier=Allied+Electronics; ComponentLink4URL: https://datasheet.ciiva.com/9005/dcrcwe3-9005498.pdf?src-supplier=Avnet; ComponentLink4Description: https://datasheet.ciiva.com/9005/dcrcwe3-9005498.pdf?src-supplier=Avnet; ComponentLink5URL: https://datasheet.ciiva.com/2469/dcrcwe3-2469054.pdf?src-supplier=Digi-Key; ComponentLink5Description: https://datasheet.ciiva.com/2469/dcrcwe3-2469054.pdf?src-supplier=Digi-Key; ComponentLink6URL: https://datasheet.ciiva.com/9005/dcrcwe3-9005502.pdf?src-supplier=Avnet; ComponentLink6Description: https://datasheet.ciiva.com/9005/dcrcwe3-9005502.pdf?src-supplier=Avnet; ComponentLink7URL: https://datasheet.ciiva.com/16435/dcrcw-16435790.pdf?src-supplier=Future+Electronics; ComponentLink7Description: https://datasheet.ciiva.com/16435/dcrcw-16435790.pdf?src-supplier=Future+Electronics; ComponentLink8URL: https://datasheet.ciiva.com/16894/dcrcwe3-16894718.pdf?src-supplier=Avnet+Europe; ComponentLink8Description: https://datasheet.ciiva.com/16894/dcrcwe3-16894718.pdf?src-supplier=Avnet+Europe; ComponentLink9URL: https://datasheet.ciiva.com/7777/1697337-7777594.pdf?src-supplier=Element14; ComponentLink9Description: https://datasheet.ciiva.com/7777/1697337-7777594.pdf?src-supplier=Element14; ComponentLink10URL: https://datasheet.ciiva.com/15159/getdatasheetpartid-67741-15159676.pdf?src-supplier=Verical; ComponentLink10Description: https://datasheet.ciiva.com/15159/getdatasheetpartid-67741-15159676.pdf?src-supplier=Verical; ComponentLink11URL: https://datasheet.ciiva.com/2469/dcrcwe3-2469055.pdf?src-supplier=Digi-Key; ComponentLink11Description: https://datasheet.ciiva.com/2469/dcrcwe3-2469055.pdf?src-supplier=Digi-Key; Price: 0.0249
R2 R3 = CRCW120647K0FKEA: RES SMD 47K OHM 1% 1/4W 1206; Manufacturer: Vishay; Resistance: 47kR; Power Rating: 250mW; Temperature Coefficient: 100ppm/°C; Voltage Rating: 200V; Supplier 1: Farnell; Supplier Part Number 1: 1470016; Manufacturer Part Number: CRCW120647K0FKEA; Stock: 31528; Pricing: 10=0.0415, 100=0.0276, 500=0.0231, 1000=0.0135, 2500=0.0116 (EUR); RoHS: Yes; Case/Package: 1206; Weight: 0.000353oz; Contact Plating: Tin; Case Code (Imperial): 1206; Case Code (Metric): 3216; Min Operating Temperature: -55°C; Max Operating Temperature: 155°C; Tolerance: 1%; Composition: Thick Film; Termination: SMD/SMT; Packaging: Tape and Reel; Package Quantity: 10; Number of Terminations: 2; Military Standard: Not; Max Power Dissipation: 250mW; Voltage Rating (DC): 200V; Features: Automotive AEC-Q200; Length: 3.2mm; Height: 0.55mm; Width: 1.6mm; Depth: 1.6mm; Radiation Hardening: No; Lead Free: Lead Free; REACH SVHC: Unknown; ComponentLink1URL: https://datasheet.ciiva.com/11809/0900766b80d98b5e-11809091.pdf?src-supplier=RSComponents; ComponentLink1Description: https://datasheet.ciiva.com/11809/0900766b80d98b5e-11809091.pdf?src-supplier=RSComponents; ComponentLink2URL: https://datasheet.ciiva.com/16894/dcrcwe3-16894709.pdf?src-supplier=Avnet+Europe; ComponentLink2Description: https://datasheet.ciiva.com/16894/dcrcwe3-16894709.pdf?src-supplier=Avnet+Europe; ComponentLink3URL: https://datasheet.ciiva.com/26316/fld-crcw-e3-data-en-26316470.pdf?src-supplier=Distrelec; ComponentLink3Description: https://datasheet.ciiva.com/26316/fld-crcw-e3-data-en-26316470.pdf?src-supplier=Distrelec; ComponentLink4URL: https://datasheet.ciiva.com/7777/1697337-7777591.pdf?src-supplier=Element14; ComponentLink4Description: https://datasheet.ciiva.com/7777/1697337-7777591.pdf?src-supplier=Element14; ComponentLink5URL: https://datasheet.ciiva.com/7777/125364-7777592.pdf?src-supplier=Element14; ComponentLink5Description: https://datasheet.ciiva.com/7777/125364-7777592.pdf?src-supplier=Element14; ComponentLink6URL: https://datasheet.ciiva.com/16380/dcrcwe3-16380760.pdf?src-supplier=Future+Electronics; ComponentLink6Description: https://datasheet.ciiva.com/16380/dcrcwe3-16380760.pdf?src-supplier=Future+Electronics; ComponentLink7URL: https://datasheet.ciiva.com/2468/dcrcwe3-2468922.pdf?src-supplier=Digi-Key; ComponentLink7Description: https://datasheet.ciiva.com/2468/dcrcwe3-2468922.pdf?src-supplier=Digi-Key; ComponentLink8URL: https://datasheet.ciiva.com/2468/dcrcwe3-2468923.pdf?src-supplier=Digi-Key; ComponentLink8Description: https://datasheet.ciiva.com/2468/dcrcwe3-2468923.pdf?src-supplier=Digi-Key; ComponentLink9URL: https://datasheet.ciiva.com/2468/dcrcwe3-2468924.pdf?src-supplier=Digi-Key; ComponentLink9Description: https://datasheet.ciiva.com/2468/dcrcwe3-2468924.pdf?src-supplier=Digi-Key; ComponentLink10URL: https://datasheet.ciiva.com/7777/1697337-7777484.pdf?src-supplier=Element14; ComponentLink10Description: https://datasheet.ciiva.com/7777/1697337-7777484.pdf?src-supplier=Element14; ComponentLink11URL: https://datasheet.ciiva.com/22868/70201119-22868605.pdf?src-supplier=Allied+Electronics; ComponentLink11Description: https://datasheet.ciiva.com/22868/70201119-22868605.pdf?src-supplier=Allied+Electronics; ComponentLink12URL: https://datasheet.ciiva.com/9006/dcrcwe3-9006431.pdf?src-supplier=Avnet; ComponentLink12Description: https://datasheet.ciiva.com/9006/dcrcwe3-9006431.pdf?src-supplier=Avnet; Price: 0.028
R4 = CRCW1206220RFKEA: RES SMD 220 OHM 1% 1/4W 1206; Manufacturer: Vishay; Temperature Coefficient: 100ppm/°C; Power Rating: 250mW; Voltage Rating: 200V; Supplier 1: Farnell; Supplier Part Number 1: 2139380; Manufacturer Part Number: CRCW1206220RFKEA; Stock: 47111; Pricing: 10=0.0415, 100=0.0276, 500=0.0231, 1000=0.0135, 2500=0.0116 (EUR); RoHS: Yes; Mount: Surface Mount; Case/Package: 1206; Weight: 0.000353oz; Contact Plating: Tin; Case Code (Imperial): 1206; Case Code (Metric): 3216; Min Operating Temperature: -55°C; Max Operating Temperature: 155°C; Tolerance: 1%; Resistance: 220R; Composition: Thick Film; Packaging: Tape and Reel; Package Quantity: 10; Number of Terminations: 2; Termination: SMD/SMT; Military Standard: Not; Max Power Dissipation: 250mW; Voltage Rating (DC): 200V; Features: Automotive AEC-Q200; Length: 3.2mm; Height: 0.55mm; Width: 1.6mm; Depth: 1.6mm; Radiation Hardening: No; REACH SVHC: Unknown; Lead Free: Lead Free; ComponentLink1URL: https://datasheet.ciiva.com/5550/dcrcwe3-109170-5550679.pdf?src-supplier=Mouser; ComponentLink1Description: https://datasheet.ciiva.com/5550/dcrcwe3-109170-5550679.pdf?src-supplier=Mouser; ComponentLink2URL: https://datasheet.ciiva.com/17166/dcrcwe3-17166378.pdf?src-supplier=Avnet+Europe; ComponentLink2Description: https://datasheet.ciiva.com/17166/dcrcwe3-17166378.pdf?src-supplier=Avnet+Europe; ComponentLink3URL: https://datasheet.ciiva.com/2515/dcrcwe3-2515580.pdf?src-supplier=Digi-Key; ComponentLink3Description: https://datasheet.ciiva.com/2515/dcrcwe3-2515580.pdf?src-supplier=Digi-Key; ComponentLink4URL: https://datasheet.ciiva.com/2515/dcrcwe3-2515581.pdf?src-supplier=Digi-Key; ComponentLink4Description: https://datasheet.ciiva.com/2515/dcrcwe3-2515581.pdf?src-supplier=Digi-Key; ComponentLink5URL: https://datasheet.ciiva.com/2515/dcrcwe3-2515582.pdf?src-supplier=Digi-Key; ComponentLink5Description: https://datasheet.ciiva.com/2515/dcrcwe3-2515582.pdf?src-supplier=Digi-Key; ComponentLink6URL: https://datasheet.ciiva.com/8957/dcrcwe3-8957438.pdf?src-supplier=Avnet; ComponentLink6Description: https://datasheet.ciiva.com/8957/dcrcwe3-8957438.pdf?src-supplier=Avnet; ComponentLink7URL: https://datasheet.ciiva.com/22700/1697337-22700367.pdf?src-supplier=Element14; ComponentLink7Description: https://datasheet.ciiva.com/22700/1697337-22700367.pdf?src-supplier=Element14; ComponentLink8URL: https://datasheet.ciiva.com/26317/fld-crcw-e3-data-en-26317129.pdf?src-supplier=Distrelec; ComponentLink8Description: https://datasheet.ciiva.com/26317/fld-crcw-e3-data-en-26317129.pdf?src-supplier=Distrelec; ComponentLink9URL: https://datasheet.ciiva.com/7800/dcrcwe3-7800651.pdf?src-supplier=Element14; ComponentLink9Description: https://datasheet.ciiva.com/7800/dcrcwe3-7800651.pdf?src-supplier=Element14; ComponentLink10URL: https://datasheet.ciiva.com/22675/1912744-22675103.pdf?src-supplier=Element14; ComponentLink10Description: https://datasheet.ciiva.com/22675/1912744-22675103.pdf?src-supplier=Element14; Price: 0.028
R5 R18 R19 = CRCW060320K0FKEA: RES SMD 20K OHM 1% 1/10W 0603; Manufacturer: Vishay; Resistance: 20kR; Temperature Coefficient: 100ppm/°C; Power Rating: 100mW; Voltage Rating: 75V; Supplier 1: Farnell; Supplier Part Number 1: 1469774; Manufacturer Part Number: CRCW060320K0FKEA; Stock: 71220; Pricing: 10=0.0169, 100=0.013, 500=0.0113, 1000=0.008 (EUR); RoHS: Yes; Mount: Surface Mount; Case/Package: 0603; Number of Pins: 2; Weight: 7.1E-05oz; Contact Plating: Tin; Case Code (Imperial): 0603; Case Code (Metric): 1608; Min Operating Temperature: -55°C; Max Operating Temperature: 155°C; Composition: Thick Film; Tolerance: 1%; Termination: SMD/SMT; Packaging: Tape and Reel; Package Quantity: 5000; Military Standard: Not; Voltage Rating (DC): 75V; Length: 1.55mm; Height: 0.45mm; Width: 0.85mm; Depth: 0.85mm; Radiation Hardening: No; Lead Free: Lead Free; REACH SVHC: Unknown; ComponentLink1URL: https://datasheet.ciiva.com/5549/dcrcwe3-109170-5549626.pdf?src-supplier=Mouser; ComponentLink1Description: https://datasheet.ciiva.com/5549/dcrcwe3-109170-5549626.pdf?src-supplier=Mouser; ComponentLink2URL: https://datasheet.ciiva.com/26314/fld-crcw-e3-data-en-26314665.pdf?src-supplier=Distrelec; ComponentLink2Description: https://datasheet.ciiva.com/26314/fld-crcw-e3-data-en-26314665.pdf?src-supplier=Distrelec; ComponentLink3URL: https://datasheet.ciiva.com/3257/dcrcwe3-3257238.pdf?src-supplier=Avnet; ComponentLink3Description: https://datasheet.ciiva.com/3257/dcrcwe3-3257238.pdf?src-supplier=Avnet; ComponentLink4URL: https://datasheet.ciiva.com/7841/1697337-7841574.pdf?src-supplier=Element14; ComponentLink4Description: https://datasheet.ciiva.com/7841/1697337-7841574.pdf?src-supplier=Element14; ComponentLink5URL: https://datasheet.ciiva.com/3257/dcrcwe3-3257239.pdf?src-supplier=Avnet; ComponentLink5Description: https://datasheet.ciiva.com/3257/dcrcwe3-3257239.pdf?src-supplier=Avnet; ComponentLink6URL: https://datasheet.ciiva.com/16351/dcrcwe3-16351112.pdf?src-supplier=Future+Electronics; ComponentLink6Description: https://datasheet.ciiva.com/16351/dcrcwe3-16351112.pdf?src-supplier=Future+Electronics; ComponentLink7URL: https://datasheet.ciiva.com/16893/dcrcw-16893852.pdf?src-supplier=Avnet+Europe; ComponentLink7Description: https://datasheet.ciiva.com/16893/dcrcw-16893852.pdf?src-supplier=Avnet+Europe; Price: 0.0131
R6 R10 R22 = CRCW06031K00FKEA: RES SMD 1K OHM 1% 1/10W 0603; Manufacturer: Vishay Dale; Resistance: 1kR; Temperature Coefficient: 100ppm/°C; Power Rating: 100mW; Voltage Rating: 75V; Supplier 1: Farnell; Supplier Part Number 1: 1469740; Manufacturer Part Number: CRCW06031K00FKEA; Stock: 1083345; Pricing: 10=0.017, 100=0.0131, 500=0.0114, 1000=0.008, 2500=0.0061 (EUR); RoHS: Yes; Mount: Surface Mount; Case/Package: 0603; Number of Pins: 2; Weight: 7.1E-05oz; Contact Plating: Tin; Case Code (Metric): 1608; Case Code (Imperial): 0603; Min Operating Temperature: -55°C; Max Operating Temperature: 155°C; Composition: Thick Film; Tolerance: 1%; Termination: SMD/SMT; Packaging: Tape and Reel; Package Quantity: 10; Number of Terminations: 2; Military Standard: Not; Max Power Dissipation: 100mW; Voltage Rating (DC): 75V; Features: Automotive AEC-Q200; Length: 1.55mm; Height: 0.45mm; Width: 0.033inch; Depth: 0.85mm; Radiation Hardening: No; Lead Free: Lead Free; REACH SVHC: Unknown; ComponentLink1URL: https://datasheet.ciiva.com/11808/0900766b80d98afc-11808625.pdf?src-supplier=RSComponents; ComponentLink1Description: https://datasheet.ciiva.com/11808/0900766b80d98afc-11808625.pdf?src-supplier=RSComponents; ComponentLink2URL: https://datasheet.ciiva.com/2465/dcrcwe3-2465536.pdf?src-supplier=Digi-Key; ComponentLink2Description: https://datasheet.ciiva.com/2465/dcrcwe3-2465536.pdf?src-supplier=Digi-Key; ComponentLink3URL: https://datasheet.ciiva.com/8336/dcrcwe3-8336822.pdf?src-supplier=Avnet; ComponentLink3Description: https://datasheet.ciiva.com/8336/dcrcwe3-8336822.pdf?src-supplier=Avnet; ComponentLink4URL: https://datasheet.ciiva.com/16515/dcrcwe3-16515078.pdf?src-supplier=Avnet+Asia; ComponentLink4Description: https://datasheet.ciiva.com/16515/dcrcwe3-16515078.pdf?src-supplier=Avnet+Asia; ComponentLink5URL: https://datasheet.ciiva.com/46441/1720486-46441622.pdf?src-supplier=Element14; ComponentLink5Description: https://datasheet.ciiva.com/46441/1720486-46441622.pdf?src-supplier=Element14; ComponentLink6URL: https://datasheet.ciiva.com/26316/fld-crcw-e3-data-en-26316551.pdf?src-supplier=Distrelec; ComponentLink6Description: https://datasheet.ciiva.com/26316/fld-crcw-e3-data-en-26316551.pdf?src-supplier=Distrelec; ComponentLink7URL: https://datasheet.ciiva.com/46441/1720486-46441623.pdf?src-supplier=Element14; ComponentLink7Description: https://datasheet.ciiva.com/46441/1720486-46441623.pdf?src-supplier=Element14; ComponentLink8URL: https://datasheet.ciiva.com/46385/1697337-46385497.pdf?src-supplier=Element14; ComponentLink8Description: https://datasheet.ciiva.com/46385/1697337-46385497.pdf?src-supplier=Element14; ComponentLink9URL: https://datasheet.ciiva.com/3257/dcrcwe3-3257132.pdf?src-supplier=Avnet; ComponentLink9Description: https://datasheet.ciiva.com/3257/dcrcwe3-3257132.pdf?src-supplier=Avnet; ComponentLink10URL: https://datasheet.ciiva.com/16199/dcrcwe3-16199053.pdf?src-supplier=Future+Electronics; ComponentLink10Description: https://datasheet.ciiva.com/16199/dcrcwe3-16199053.pdf?src-supplier=Future+Electronics; ComponentLink11URL: https://datasheet.ciiva.com/2465/dcrcwe3-2465534.pdf?src-supplier=Digi-Key; ComponentLink11Description: https://datasheet.ciiva.com/2465/dcrcwe3-2465534.pdf?src-supplier=Digi-Key; ComponentLink12URL: https://datasheet.ciiva.com/16893/dcrcwe3-16893742.pdf?src-supplier=Avnet+Europe; ComponentLink12Description: https://datasheet.ciiva.com/16893/dcrcwe3-16893742.pdf?src-supplier=Avnet+Europe; ComponentLink13URL: https://datasheet.ciiva.com/2465/dcrcwe3-2465535.pdf?src-supplier=Digi-Key; ComponentLink13Description: https://datasheet.ciiva.com/2465/dcrcwe3-2465535.pdf?src-supplier=Digi-Key; Price: 0.013